# Altium schematic sheet MicroMultimeter_MAIN_Sch.SchDoc: MicroMultimeter
size 203 x 127 mm; Author: Hom; CompanyName: KitSprout; DrawnBy: Hom; Engineer: Hom; Organization: KitSprout; Revision: B; SheetNumber: 1; SheetTotal: 1; License: CC BY-SA 4.0; Version: 1.0; LibVersion: 1.4; PageSetup: Record=PageOptions|CenterHorizontal=True|CenterVertical=True|PrintScale=1.00|XCorrection=1.00|YCorrection=1.00|PrintKind=0|BorderSize=5000000|LeftOffset=0|BottomOffset=0|Orientation=2|PaperLength=1000|PaperWidth=1000|Scale=100|PaperSource=7|PrintQuality=-3|MediaType=1|DitherType=10|PrintScaleMode=0|PaperKind=A4|PaperIndex=9
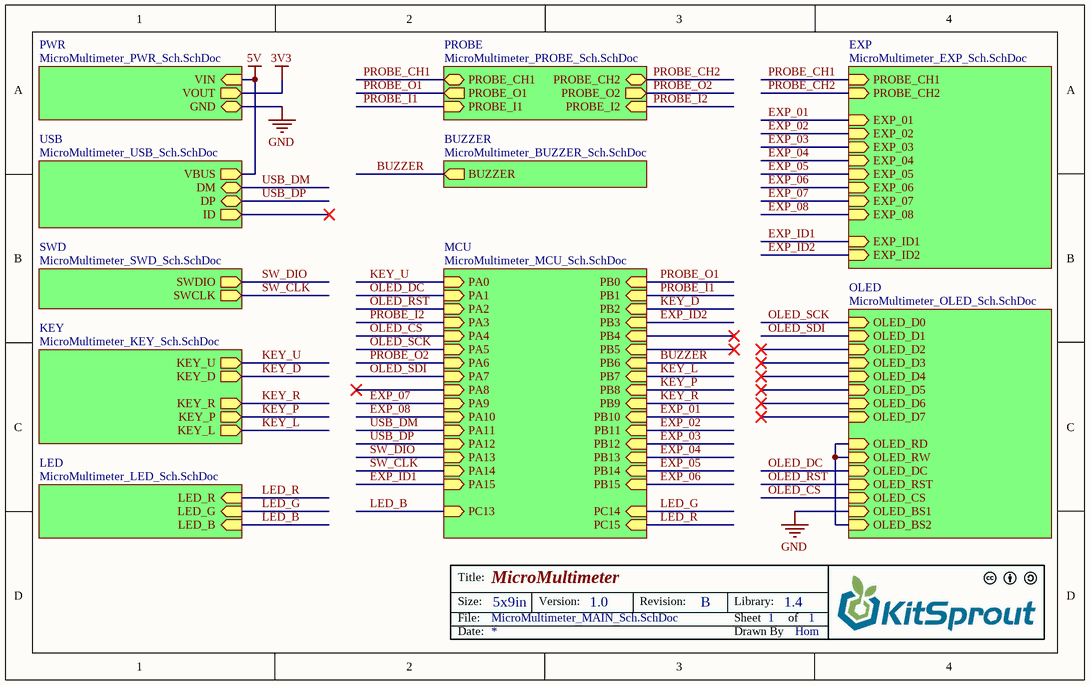
[diagram p0: MicroMultimeter_MAIN_Sch.SchDoc]

## Sub-sheets
BUZZER = MicroMultimeter_BUZZER_Sch.SchDoc: BUZZER (out)
EXP = MicroMultimeter_EXP_Sch.SchDoc: PROBE_CH1 (in), PROBE_CH2 (in), EXP_01 (in), EXP_02 (in), EXP_03 (in), EXP_04 (in), EXP_05 (in), EXP_06 (in), EXP_07 (in), EXP_08 (in), EXP_ID1 (in), EXP_ID2 (in)
KEY = MicroMultimeter_KEY_Sch.SchDoc: KEY_D (out), KEY_U (out), KEY_P (out), KEY_R (out), KEY_L (out)
LED = MicroMultimeter_LED_Sch.SchDoc: LED_G (in), LED_R (in), LED_B (in)
MCU = MicroMultimeter_MCU_Sch.SchDoc: PA0 (in), PA1 (in), PA2 (in), PA3 (in), PA4 (in), PA5 (in), PA6 (in), PA7 (in), PA8 (in), PA9 (in), PA10 (in), PA11 (in), PA12 (in), PA13 (in), PA14 (in), PA15 (in), PB0 (in), PB1 (in), PB2 (in), PB3 (in), PB4 (in), PB5 (in), PB6 (in), PB7 (in), PB8 (in), PB9 (in), PB10 (in), PB11 (in), PB12 (in), PB13 (in), PB14 (in), PB15 (in), PC13 (in), PC14 (in), PC15 (in)
OLED = MicroMultimeter_OLED_Sch.SchDoc: OLED_D0 (in), OLED_D1 (in), OLED_D2 (in), OLED_D3 (in), OLED_D4 (in), OLED_D5 (in), OLED_D6 (in), OLED_D7 (in), OLED_RD (in), OLED_RW (in), OLED_DC (in), OLED_RST (in), OLED_CS (in), OLED_BS1 (in), OLED_BS2 (in)
PROBE = MicroMultimeter_PROBE_Sch.SchDoc: PROBE_CH2 (bidir), PROBE_CH1 (bidir), PROBE_I1 (in), PROBE_I2 (in), PROBE_O1 (out), PROBE_O2 (out)
PWR = MicroMultimeter_PWR_Sch.SchDoc: VOUT (out), VIN (in), GND (bidir)
SWD = MicroMultimeter_SWD_Sch.SchDoc: SWDIO (out), SWCLK (out)
USB = MicroMultimeter_USB_Sch.SchDoc: DM (bidir), VBUS (out), DP (bidir), ID (out)

## Nets
3V3: sheet PWR/VOUT
5V: sheet PWR/VIN, sheet USB/VBUS
GND: sheet PWR/GND, sheet OLED/OLED_BS1
BUZZER: sheet BUZZER/BUZZER, sheet MCU/PB6
EXP_01: sheet EXP/EXP_01, sheet MCU/PB10
EXP_02: sheet EXP/EXP_02, sheet MCU/PB11
EXP_03: sheet EXP/EXP_03, sheet MCU/PB12
EXP_04: sheet EXP/EXP_04, sheet MCU/PB13
EXP_05: sheet EXP/EXP_05, sheet MCU/PB14
EXP_06: sheet EXP/EXP_06, sheet MCU/PB15
EXP_07: sheet EXP/EXP_07, sheet MCU/PA9
EXP_08: sheet EXP/EXP_08, sheet MCU/PA10
EXP_ID1: sheet EXP/EXP_ID1, sheet MCU/PA15
EXP_ID2: sheet EXP/EXP_ID2, sheet MCU/PB3
KEY_D: sheet KEY/KEY_D, sheet MCU/PB2
KEY_L: sheet KEY/KEY_L, sheet MCU/PB7
KEY_P: sheet KEY/KEY_P, sheet MCU/PB8
KEY_R: sheet KEY/KEY_R, sheet MCU/PB9
KEY_U: sheet KEY/KEY_U, sheet MCU/PA0
LED_B: sheet LED/LED_B, sheet MCU/PC13
LED_G: sheet LED/LED_G, sheet MCU/PC14
LED_R: sheet LED/LED_R, sheet MCU/PC15
OLED_CS: sheet OLED/OLED_CS, sheet MCU/PA4
OLED_DC: sheet OLED/OLED_DC, sheet MCU/PA1
OLED_RST: sheet OLED/OLED_RST, sheet MCU/PA2
OLED_SCK: sheet OLED/OLED_D0, sheet MCU/PA5
OLED_SDI: sheet OLED/OLED_D1, sheet MCU/PA7
PROBE_CH1: sheet PROBE/PROBE_CH1, sheet EXP/PROBE_CH1
PROBE_CH2: sheet PROBE/PROBE_CH2, sheet EXP/PROBE_CH2
PROBE_I1: sheet PROBE/PROBE_I1, sheet MCU/PB1
PROBE_I2: sheet PROBE/PROBE_I2, sheet MCU/PA3
PROBE_O1: sheet PROBE/PROBE_O1, sheet MCU/PB0
PROBE_O2: sheet PROBE/PROBE_O2, sheet MCU/PA6
SW_CLK: sheet SWD/SWCLK, sheet MCU/PA14
SW_DIO: sheet SWD/SWDIO, sheet MCU/PA13
USB_DM: sheet USB/DM, sheet MCU/PA11
USB_DP: sheet USB/DP, sheet MCU/PA12
(unnamed): sheet OLED/OLED_RD, sheet OLED/OLED_RW, sheet OLED/OLED_BS2

## Notes on the sheet
- Title:
- Size:
- Date:
- File:
- 5x9in
- Version:
- Revision:
- Sheet
- Drawn By
- Library:
- of